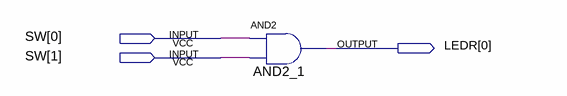
[diagram p0: schematic sheet]
// Quartus schematic GateDemo.bdf as structural Verilog: 1 symbols, 3 pins
module GateDemo (
  input  [1:0] SW,
  output [0:0] LEDR
);

  and AND2_1 (LEDR[0], SW[0], SW[1]);
endmodule
